# EAGLE board monitoring_board (EAGLE 9.5.1), part 1 of 2
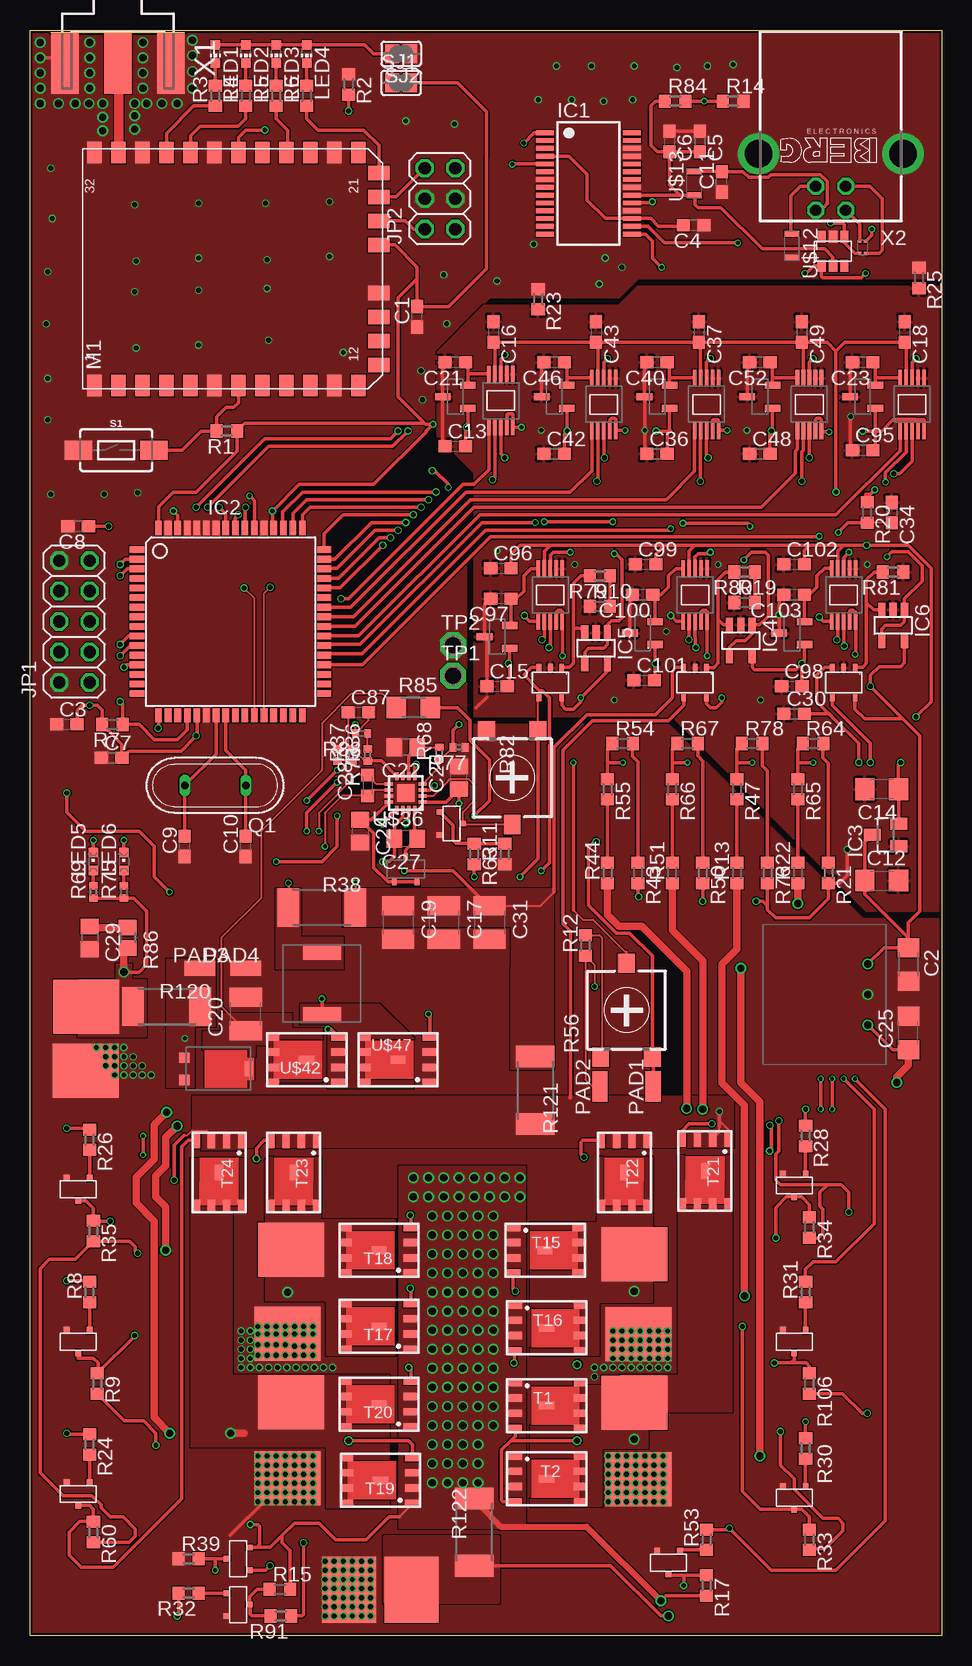
[diagram p5: board, top side]
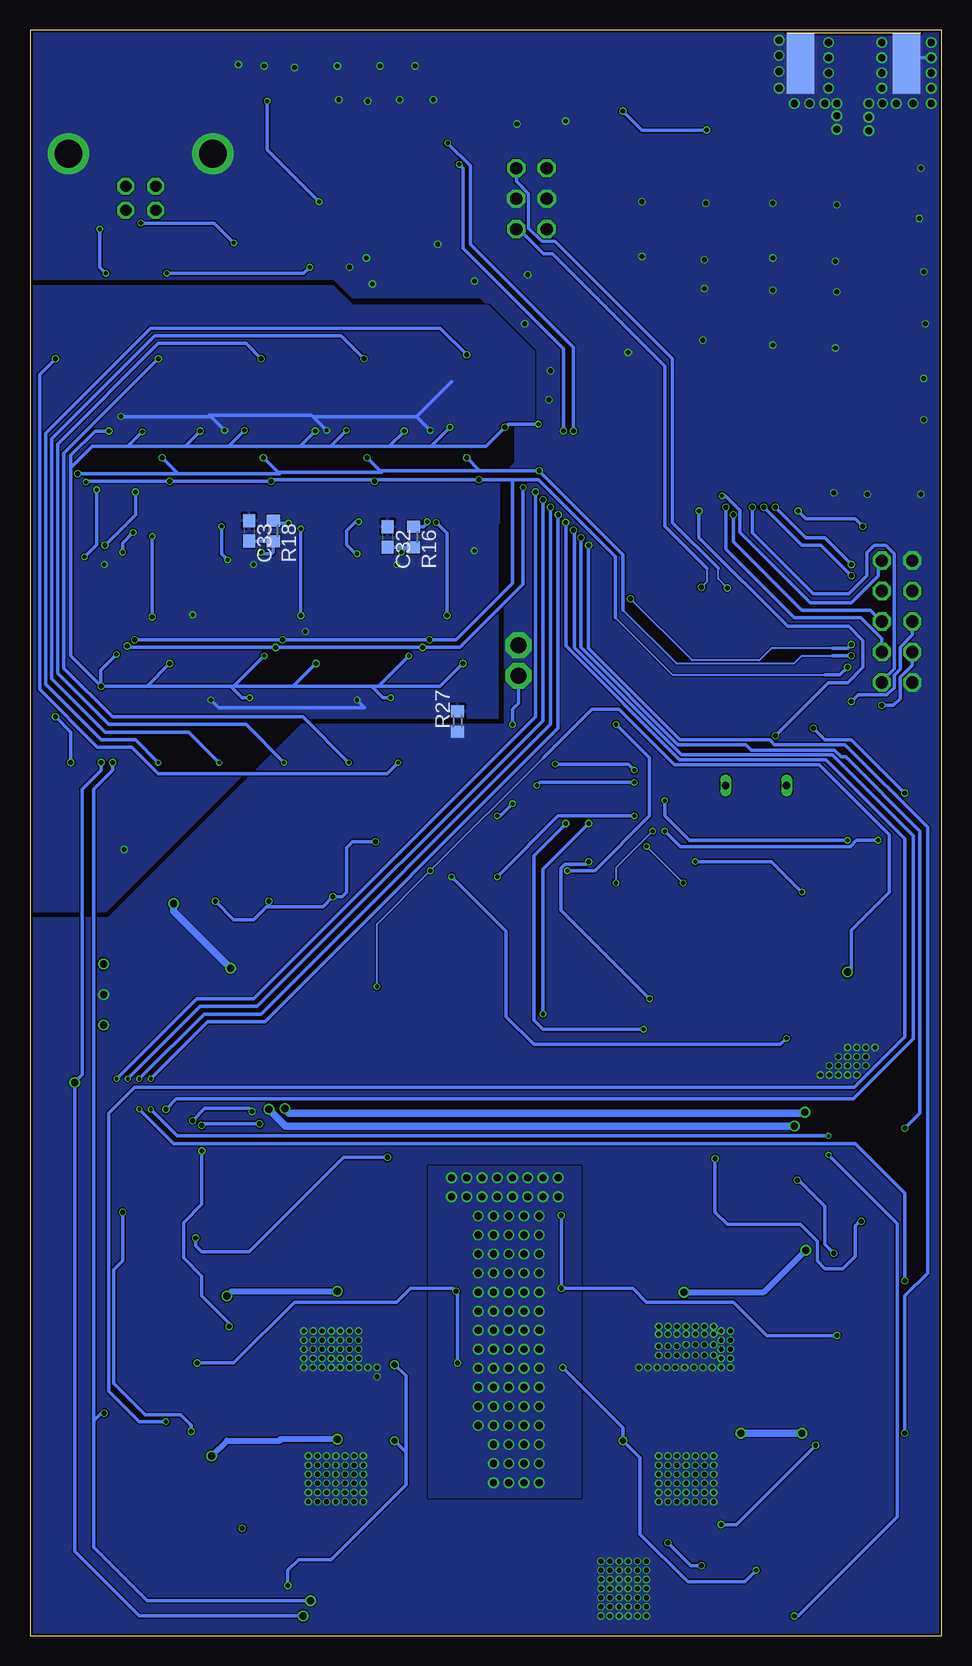
[diagram p6: board, bottom side, seen from below]

Size 76 x 133.8 mm. Coordinates in mm from the lower left corner, seen from the top.
Outline: 0,133.8 76,133.8 76,0 0,0 0,133.8
Copper layers (1*16): Top 0.018mm / dielectric 1.55mm / Bottom 0.018mm
Design rules "Multi-CB_2L_100Êm-Tracks_OL35Êm": minimum track width 0.1mm, minimum drill 0.2mm, track to track 0.1mm, track to pad 0.1mm, pad to pad 0.1mm, via to via 0.1mm, smd to smd 0mil, copper to edge 0.2mm, drill to drill 0.2mm, minimum pad ring 0.125mm, minimum via ring 0.1mm, stop-mask expansion 2mil, vias tented up to drill 0.45mm, thermal gap 0.2mm
Net classes: 1 ant: width 0.8 mm, clearance 0.1 mm

## Footprints (pad centres in the part's own frame; a part is rotated, then mirrored left to right if it is on the bottom)
SMDPAD = smd 4.5 x 5.5: 1 0.03,0.02
C0603 = smd 1.1 x 1: 1 -0.85,0; 2 0.85,0
C1206 = smd 1.6 x 1.8: 1 -1.4,0; 2 1.4,0
C1210 = smd 1.6 x 2.7: 1 -1.4,0; 2 1.4,0
C0805 = smd 1.3 x 1.5: 1 -0.95,0; 2 0.95,0
C0603K = smd 1.05 x 1.08: 1 -0.875,0; 2 0.875,0
SSOP28 = smd 0.4 x 1.5: 1 -4.225,-3.625; 2 -3.575,-3.625; 3 -2.925,-3.625; 4 -2.275,-3.625; 5 -1.625,-3.625; 6 -0.975,-3.625; 7 -0.325,-3.625; 8 0.325,-3.625; 9 0.975,-3.625; 10 1.625,-3.625; 11 2.275,-3.625; 12 2.925,-3.625; 13 3.575,-3.625; 14 4.225,-3.625; 15 4.225,3.625; 16 3.575,3.625; 17 2.925,3.625; 18 2.275,3.625; 19 1.625,3.625; 20 0.975,3.625; 21 0.325,3.625; 22 -0.325,3.625; 23 -0.975,3.625; 24 -1.625,3.625; 25 -2.275,3.625; 26 -2.925,3.625; 27 -3.575,3.625; 28 -4.225,3.625
TQFP64 = smd 1.194 x 0.559: 1 -7.8,6; 2 -7.8,5.2; 3 -7.8,4.4; 4 -7.8,3.6; 5 -7.8,2.8; 6 -7.8,2; 7 -7.8,1.2; 8 -7.8,0.4; 9 -7.8,-0.4; 10 -7.8,-1.2; 11 -7.8,-2; 12 -7.8,-2.8; 13 -7.8,-3.6; 14 -7.8,-4.4; 15 -7.8,-5.2; 16 -7.8,-6; 33 7.8,-6; 34 7.8,-5.2; 35 7.8,-4.4; 36 7.8,-3.6; 37 7.8,-2.8; 38 7.8,-2; 39 7.8,-1.2; 40 7.8,-0.4; 41 7.8,0.4; 42 7.8,1.2; 43 7.8,2; 44 7.8,2.8; 45 7.8,3.6; 46 7.8,4.4; 47 7.8,5.2; 48 7.8,6 | smd 0.559 x 1.194: 17 -6,-7.8; 18 -5.2,-7.8; 19 -4.4,-7.8; 20 -3.6,-7.8; 21 -2.8,-7.8; 22 -2,-7.8; 23 -1.2,-7.8; 24 -0.4,-7.8; 25 0.4,-7.8; 26 1.2,-7.8; 27 2,-7.8; 28 2.8,-7.8; 29 3.6,-7.8; 30 4.4,-7.8; 31 5.2,-7.8; 32 6,-7.8; 49 6,7.8; 50 5.2,7.8; 51 4.4,7.8; 52 3.6,7.8; 53 2.8,7.8; 54 2,7.8; 55 1.2,7.8; 56 0.4,7.8; 57 -0.4,7.8; 58 -1.2,7.8; 59 -2,7.8; 60 -2.8,7.8; 61 -3.6,7.8; 62 -4.4,7.8; 63 -5.2,7.8; 64 -6,7.8
SOT23 = smd 1 x 1.4: 1 -0.95,-1.1; 2 0.95,-1.1; 3 0,1.1
SOT23-5 = smd 0.6 x 1.2: 1 -0.95,-1.306; 2 0,-1.306; 3 0.95,-1.306; 4 0.95,1.306; 5 -0.95,1.306
2X05 = drill 1.016 octagon: 1 -5.08,-1.27; 2 -5.08,1.27; 3 -2.54,-1.27; 4 -2.54,1.27; 5 0,-1.27; 6 0,1.27; 7 2.54,-1.27; 8 2.54,1.27; 9 5.08,-1.27; 10 5.08,1.27
2X03 = drill 1.016 octagon: 1 -2.54,-1.27; 2 -2.54,1.27; 3 0,-1.27; 4 0,1.27; 5 2.54,-1.27; 6 2.54,1.27
CHIP-LED0603 = smd 0.8 x 0.8: A 0,-0.75; C 0,0.75
CHIPLED_0603 = smd 0.8 x 0.8: A 0,-0.75; C 0,0.75
IM-X8X = smd 1.8 x 1.2: P$1 0,-2; P$2 0,-4; P$3 0,-6; P$4 0,-8; P$5 0,-10; P$6 0,-12; P$7 0,-14; P$8 0,-16; P$9 0,-18; P$10 0,-20; P$11 0,-22; P$12 0,-24; P$21 19.4,-24; P$22 19.4,-22; P$23 19.4,-20; P$24 19.4,-18; P$25 19.4,-16; P$26 19.4,-14; P$27 19.4,-12; P$28 19.4,-10; P$29 19.4,-8; P$30 19.4,-6; P$31 19.4,-4; P$32 19.4,-2 | smd 1.2 x 1.8: P$13 1.7,-25.7; P$14 3.7,-25.7; P$15 5.7,-25.7; P$16 7.7,-25.7; P$17 11.7,-25.7; P$18 13.7,-25.7; P$19 15.7,-25.7; P$20 17.7,-25.7
SMD1,27-2,54 = smd 1.27 x 2.54: 1 0,0
QS = drill 0.61 long: 1 -2.54,0; 2 2.54,0
R0603 = smd 1 x 1.1: 1 -0.85,0; 2 0.85,0
R0402 = smd 0.6 x 0.7: 1 -0.5,0; 2 0.5,0
R2512 = smd 1.8 x 3.2: 1 -2.8,0; 2 2.8,0
RTRIMCA6 = smd 1.4 x 1.6: 1 -2.15,-3.9; 2 0,3.9; 3 2.15,-3.9
R1206 = smd 1.6 x 1.803: 1 -1.422,0; 2 1.422,0
R2012 = smd 1.3 x 1.5: 1 -0.85,0; 2 0.85,0
TACTILE_SWITCH_SMD_6.0X3.5MM = smd 2.3 x 1.6: 1 -3.15,0; 2 3.15,0
SJ = smd 1.168 x 1.6: 1 -0.762,0; 2 0.762,0
SI7157DP = smd 1.27 x 0.61: 1 -2.67,1.905; 2 -2.67,0.635; 3 -2.67,-0.635; 4 -2.67,-1.905 | smd 1.02 x 0.61: 5 2.795,-1.905; 6 2.795,-0.635; 7 2.795,0.635; 8 2.795,1.905 | smd 1.27 x 0.635: 9 0,0
P1-13 = drill 1.321 pad 2.159 octagon: TP 0,0
TSR-1-XXXX = drill 0.6: P$1 -2.5,-3.6; P$2 0.04,-3.6; P$3 2.58,-3.6
NXP_BC847 = smd 0.48 x 0.55: 1 -0.95,-0.953; 2 0.95,-0.953; 3 0,0.953
REF31XX-Q1 = smd 0.6 x 1.3: 1 0.95,1.05; 2 -0.95,1.05; 3 0,-1.05
NXP_BC857 = smd 0.48 x 0.55: 1 -0.95,-0.953; 2 0.95,-0.953; 3 0,0.953
MCP33131-05 = smd 0.3 x 1.4: 1 -1,2.2; 2 -0.5,2.2; 3 0,2.2; 4 0.5,2.2; 5 1,2.2; 6 -1,-2.2; 7 -0.5,-2.2; 8 0,-2.2; 9 0.5,-2.2; 10 1,-2.2
DLP11SN900HL2 = smd 0.25 x 0.3: 1 -0.5,0.252; 2 0.501,0.252; 3 0.501,-0.252; 4 -0.5,-0.252
BLM21PG221SN1 = smd 0.5 x 1.25: 1 -1,0; 2 1,0
NUP2201MR6 = smd 0.7 x 1: 1 -0.95,-1.2; 2 0,-1.2; 3 0.95,-1.2; 4 -0.95,1.2; 5 0,1.2; 6 0.95,1.2
INA138 = smd 0.4 x 0.625: 1 0.95,1.25; 2 0,1.25; 3 -0.95,1.25; 4 -0.95,-1.25; 5 0.95,-1.25
BQ24650 = smd 0.7 x 0.3: 1 -1.4,0.75; 2 -1.4,0.25; 3 -1.4,-0.25; 4 -1.4,-0.75; 9 1.4,-0.75; 10 1.4,-0.25; 11 1.4,0.25; 12 1.4,0.75 | smd 0.3 x 0.7: 5 -0.75,-1.4; 6 -0.25,-1.4; 7 0.25,-1.4; 8 0.75,-1.4; 13 0.75,1.4; 14 0.25,1.4; 15 -0.25,1.4; 16 -0.75,1.4 | smd 1.45 x 1.45: EXP 0,0
SIR404DP = smd 1.27 x 0.61: 1 -2.67,1.905; 2 -2.67,0.635; 3 -2.67,-0.635; 4 -2.67,-1.905 | smd 1.02 x 0.61: 5 2.795,-1.905; 6 2.795,-0.635; 7 2.795,0.635; 8 2.795,1.905 | smd 1.27 x 0.635: 9 0,0
IHLP-2525CZ-01 = smd 1.27 x 3.18: 1 -2.6,0; 2 2.6,0
2N7002 = smd 0.48 x 0.55: 1 -0.95,-0.953; 2 0.95,-0.953; 3 0,0.953
BAT54C = smd 0.4 x 0.6: 1 -0.95,-1.05; 2 0.95,-1.05; 3 0,1.05
PDS1040 = smd 0.89 x 0.85: 1 -2.83,0.92; 2 -2.83,-0.92 | smd 0.635 x 1.27: P$1 2.54,0
J502-ND-142-0701-801/806 = smd 5.08 x 2.286: 1 2.565,0; G@1 2.565,4.42; G@2 2.565,-4.42 | smd 5.08 x 2.286 bottom: G@3 2.565,4.42; G@4 2.565,-4.42
PN61729-S = drill 0.95 octagon: 1 1.25,4.71; 2 -1.25,4.71; 3 -1.25,2.71; 4 1.25,2.71 | drill 2.3 pad 2.9: S1 -6.02,0; S2 6.02,0

## Placement (x,y rotation side)
+V_LOAD  SMDPAD  [SMDPAD]  31.83,3.86 180 top
BAT0+  SMDPAD  [SMDPAD]  50.38,19.41 270 top
BAT0-  SMDPAD  [SMDPAD]  50.69,13.06 270 top
BAT1+  SMDPAD  [SMDPAD]  50.38,31.8 270 top
BAT1-  SMDPAD  [SMDPAD]  50.69,25.13 270 top
BAT2+  SMDPAD  [SMDPAD]  21.8,32.11 90 top
BAT2-  SMDPAD  [SMDPAD]  21.48,25.13 90 top
BAT3+  SMDPAD  [SMDPAD]  21.8,19.41 90 top
BAT3-  SMDPAD  [SMDPAD]  21.48,13.06 90 top
C1  1u/6,3V  [C0603]  32.28,109.9 90 top
C2  10u/5,6V  [C1206]  73.23,55.93 270 top
C3  100n  [C0603]  3.07,75.93 0 top
C4  100n  [C0603]  55.33,117.52 180 top
C5  4.7u  [C0603]  55.84,124.51 270 top
C6  100n  [C0603]  53.3,124.51 270 top
C7  100n  [C0603]  6.81,73.14 0 top
C8  100n  [C0603]  4.02,92.44 180 top
C9  22p  [C0603]  12.91,65.77 90 top
C10  22p  [C0603]  17.99,65.77 90 top
C11  10n  [C0603]  57.68,121.14 90 top
C12  1u/5,6V  [C1206]  71.01,62.91 0 top
C13  100n  [C0603]  35.45,99.11 0 top
C14  1u/5.6V  [C1206]  71.01,70.53 180 top
C15  100n  [C0603]  38.95,79.11 0 top
C16  100n  [C0603]  38.63,108.63 270 top
C17  22u/35V  [C1210]  34.5,59.42 270 top
C18  100n  [C0603]  72.92,108.63 270 top
C19  10uF/35V  [C1210]  30.69,59.42 270 top
C20  10uF  [C1210]  17.99,51.8 90 top
C21  10u  [C0603]  35.45,106.09 180 top
C22  1uF  [C0805]  31.32,74.03 180 top
C23  10u  [C0603]  69.42,106.09 180 top
C24  1uF  [C0805]  27.52,67.04 270 top
C25  47u/25V  [C1206]  73.23,50.21 90 top
C26  1uF  [C0805]  35.77,71.48 90 top
C27  100nF  [C0805]  31.32,66.41 180 top
C28  0.1uF  [C0603K]  28.15,70.85 90 top
C29  2.2uF  [C0805]  4.97,58.15 270 top
C30  100n  [C0603]  63.71,76.82 0 top
C31  10uF/35V  [C1210]  38.31,59.42 270 top
C32  3300p  [C0603]  46.18,91.55 270 bottom
C33  3300p  [C0603]  57.74,92.06 270 bottom
C34  3300p  [C0603]  71.84,93.58 270 top
C36  100n  [C0603]  52.28,98.47 0 top
C37  100n  [C0603]  55.77,108.63 270 top
C40  10u  [C0603]  52.28,106.09 180 top
C42  100n  [C0603]  43.71,98.47 0 top
C43  100n  [C0603]  47.2,108.63 270 top
C46  10u  [C0603]  43.71,106.09 180 top
C48  100n  [C0603]  60.85,98.47 0 top
C49  100n  [C0603]  64.34,108.63 270 top
C52  10u  [C0603]  60.85,106.09 180 top
C87  22p  [C0603]  27.39,76.95 0 top
C95  100n  [C0603]  69.42,98.79 0 top
C96  100n  [C0603]  39.26,88.95 0 top
C97  10u  [C0603]  39.26,86.41 180 top
C98  100n  [C0603]  63.52,79.11 0 top
C99  100n  [C0603]  51.33,89.27 0 top
C100  10u  [C0603]  51.07,86.72 180 top
C101  100n  [C0603]  51.2,79.61 0 top
C102  100n  [C0603]  63.71,89.27 0 top
C103  10u/5.6V  [C0603]  63.71,86.72 180 top
IC1  FT232RL  [SSOP28]  46.56,121.02 270 top
IC2  MEGA64-A  [TQFP64]  16.72,84.5 0 top
IC3  MCP1703CB  [SOT23]  71.33,66.72 90 top
IC4  OPA340N  [SOT23-5]  59.27,82.92 180 top
IC5  OPA340N  [SOT23-5]  47.2,82.28 180 top
IC6  OPA340N  [SOT23-5]  71.97,84.19 180 top
JP1  [2X05]  3.7,84.5 90 top
JP2  [2X03]  34.18,119.75 90 top
LED1  green  [CHIP-LED0603]  15.45,131.81 180 top
LED2  green  [CHIP-LED0603]  17.99,131.81 180 top
LED3  green  [CHIP-LED0603]  20.53,131.81 180 top
LED4  green  [CHIP-LED0603]  23.07,131.81 180 top
LED5  green  [CHIPLED_0603]  5.29,64.5 0 top
LED6  green  [CHIPLED_0603]  7.83,64.5 0 top
M1  IM-X8X  [IM-X8X]  3.39,104.19 90 top
PAD1  V-R56  [SMD1,27-2,54]  51.96,45.77 0 top
PAD2  V+R56  [SMD1,27-2,54]  47.52,45.77 0 top
PAD3  V+R82  [SMD1,27-2,54]  14.18,55.61 90 top
PAD4  V-R82  [SMD1,27-2,54]  17.99,55.61 90 top
Q1  7.3728 MHz  [QS]  15.45,70.85 180 top
R1  47k  [R0603]  16.4,100.38 180 top
R2  47k  [R0603]  26.56,129.27 270 top
R3  47k  [R0603]  15.45,128.32 90 top
R4  47k  [R0603]  17.99,128.32 90 top
R5  47k  [R0603]  20.53,128.32 90 top
R6  47k  [R0603]  23.07,128.32 90 top
R7  47k  [R0603]  6.88,75.93 180 top
R8  1k  [R0603]  4.97,28.62 90 top
R9  18k  [R0603]  5.61,21 270 top
R10  0R  [R0603]  47.52,85.77 0 top
R11  1k  [R0603]  39.58,65.14 90 top
R12  50k  [R0603]  46.31,57.52 90 top
R13  10k  [R0603]  58.95,63.55 90 top
R14  10k  [R0603]  58.63,127.87 0 top
R15  18k  [R0603]  20.85,3.86 0 top
R16  500R  [R0603]  44.02,91.55 270 bottom
R17  18k  [R0603]  56.41,4.17 270 top
R18  500R  [R0603]  55.71,92.06 270 bottom
R19  0R  [R0603]  59.58,86.09 0 top
R20  500  [R0603]  69.81,93.58 270 top
R21  3k9  [R0603]  66.57,63.55 270 top
R22  10k  [R0603]  64.03,63.55 90 top
R23  0R  [R0603]  42.37,111.36 270 top
R24  1k  [R0603]  4.97,15.92 270 top
R25  0R  [R0603]  74.12,113.14 270 top
R26  1k  [R0603]  4.97,41.32 270 top
R27  0R  [R0603]  40.34,76.18 90 bottom
R28  1k  [R0603]  64.66,41.64 270 top
R30  1k  [R0603]  64.66,15.61 270 top
R31  1k  [R0603]  64.66,28.62 90 top
R32  1k  [R0603]  13.23,3.54 180 top
R33  1k  [R0603]  64.98,7.99 270 top
R34  1k  [R0603]  64.98,34.02 270 top
R35  1k  [R0603]  5.29,33.7 270 top
R36  150k 1%  [R0402]  28.15,73.39 90 top
R37  100k 1%  [R0402]  26.88,73.39 90 top
R38  0R0065  [R2512]  24.34,60.69 0 top
R39  18k  [R0603]  13.23,6.4 0 top
R43  3k9  [R0603]  50.69,63.55 270 top
R44  10k  [R0603]  48.15,63.55 90 top
R47  0  [R0603]  58.95,70.53 270 top
R50  3k9  [R0603]  56.09,63.55 270 top
R51  10k  [R0603]  53.55,63.55 90 top
R53  1k  [R0603]  56.41,7.99 90 top
R54  0R  [R0603]  49.42,74.34 0 top
R55  0R  [R0603]  48.15,70.53 270 top
R56  10k  [RTRIMCA6]  49.74,52.12 0 top
R60  1k  [R0603]  5.29,8.62 270 top
R63  1k  [R0603]  37.04,65.14 270 top
R64  0  [R0603]  65.3,74.34 0 top
R65  0  [R0603]  64.03,70.53 270 top
R66  0R  [R0603]  53.55,70.53 270 top
R67  0R  [R0603]  54.82,74.34 0 top
R68  10k  [R0402]  34.12,73.52 90 top
R69  10k  [R0402]  5.29,61.96 90 top
R73  0R  [R0402]  25.61,73.39 270 top
R75  10k  [R0402]  7.83,61.96 90 top
R76  3k9  [R0603]  61.49,63.55 270 top
R77  15k  [R0402]  35.77,74.03 180 top
R78  0  [R0603]  60.22,74.34 0 top
R79  560K  [R0603]  47.52,88.31 180 top
R80  560k  [R0603]  59.58,88.63 180 top
R81  820k  [R0603]  71.97,88.63 180 top
R82  [RTRIMCA6]  40.22,71.48 180 top
R84  4k7  [R0603]  53.8,127.87 0 top
R85  10R  [R1206]  31.96,77.33 0 top
R86  2R  [R2012]  8.15,58.15 270 top
R88  150k 1%  [R0402]  27.64,75.17 180 top
R91  1k  [R0603]  20.91,1.64 180 top
R106  18k  [R0603]  64.98,21 270 top
R120  0R003  [R2512]  11.39,52.44 0 top
R121  0R003  [R2512]  42.12,45.45 270 top
R122  500u  [R2512]  37.04,8.62 90 top
S1  MOMENTARY-SWITCH-SPST-SMD-6.0X3.5MM  [TACTILE_SWITCH_SMD_6.0X3.5MM]  7.2,98.79 0 top
SJ1  [SJ]  30.94,129.4 0 top
SJ2  [SJ]  30.94,131.81 180 top
SOLAR+  SMDPAD  [SMDPAD]  4.66,52.44 270 top
SOLAR-  SMDPAD  [SMDPAD]  4.66,47.04 90 top
T1  [SI7157DP]  43.07,19.16 0 top
T2  [SI7157DP]  43.07,13.06 0 top
T15  [SI7157DP]  42.95,32.11 0 top
T16  [SI7157DP]  43.07,25.64 0 top
T17  [SI7157DP]  29.1,25.77 180 top
T18  [SI7157DP]  29.1,32.11 180 top
T19  [SI7157DP]  29.23,12.94 180 top
T20  [SI7157DP]  29.1,19.29 180 top
T21  [SI7157DP]  56.28,38.72 270 top
T22  [SI7157DP]  49.55,38.59 270 top
T23  [SI7157DP]  21.99,38.59 270 top
T24  [SI7157DP]  15.77,38.59 270 top
TP1  PTR1PAD1-13  [P1-13]  35.26,79.99 0 top
TP2  PTR1PAD1-13  [P1-13]  35.26,82.53 0 top
U$1  TSR-1-XXXX  [TSR-1-XXXX]  66.25,53.39 90 top
U$2  NXP_BC847  [NXP_BC847]  53.23,6.08 180 top
U$4  REF3125-Q1  [REF31XX-Q1]  35.45,103.23 270 top
U$5  REF3125-Q1  [REF31XX-Q1]  43.71,103.23 270 top
U$6  REF3125-Q1  [REF31XX-Q1]  51.07,83.55 270 top
U$8  REF3125-Q1  [REF31XX-Q1]  38.95,83.23 270 top
U$9  NXP_BC857  [NXP_BC857]  17.36,6.4 90 top
U$10  MCP33131-05  [MCP33131-05]  73.55,102.6 0 top
U$11  DLP11SN900HL2  [DLP11SN900HL2]  69.42,115.68 90 top
U$12  BLM21PG221SN1  [BLM21PG221SN1]  63.52,115.81 270 top
U$13  BLM21PG221SN1  [BLM21PG221SN1]  55.39,121.02 90 top
U$14  DUP2201MR6  [NUP2201MR6]  66.95,115.36 180 top
U$16  MCP33131-05  [MCP33131-05]  39.26,102.92 0 top
U$17  MCP33131-05  [MCP33131-05]  47.84,102.6 0 top
U$18  REF3125-Q1  [REF31XX-Q1]  69.42,103.23 270 top
U$19  REF3125-Q1  [REF31XX-Q1]  63.52,83.55 270 top
U$20  MCP33131-05  [MCP33131-05]  56.41,102.6 0 top
U$21  MCP33131-05  [MCP33131-05]  64.98,102.6 0 top
U$22  REF3125-Q1  [REF31XX-Q1]  60.85,103.23 270 top
U$23  REF3125-Q1  [REF31XX-Q1]  52.28,103.23 270 top
U$24  MCP33131-05  [MCP33131-05]  43.39,86.72 0 top
U$25  MCP33131-05  [MCP33131-05]  55.45,86.72 0 top
U$26  MCP33131-05  [MCP33131-05]  67.84,86.72 0 top
U$27  INA138  [INA138]  55.45,79.42 0 top
U$28  INA138  [INA138]  43.39,79.42 0 top
U$29  INA138  [INA138]  67.84,79.42 0 top
U$34  NXP_BC847  [NXP_BC847]  63.71,24.5 180 top
U$35  NXP_BC847  [NXP_BC847]  4.02,24.5 180 top
U$36  BQ24650  [BQ24650]  31.32,70.22 180 top
U$37  NXP_BC847  [NXP_BC847]  17.36,2.59 270 top
U$38  NXP_BC847  [NXP_BC847]  63.71,11.48 180 top
U$39  NXP_BC847  [NXP_BC847]  63.71,37.51 180 top
U$40  NXP_BC847  [NXP_BC847]  4.02,37.2 180 top
U$41  NXP_BC847  [NXP_BC847]  4.02,11.79 180 top
U$42  SIR404DP  [SIR404DP]  23.07,47.99 180 top
U$45  4.7uH /Würth 784 778 047  [IHLP-2525CZ-01]  24.34,54.34 90 top
U$46  2N7002  [2N7002]  35.13,67.67 270 top
U$47  SIR404DP  [SIR404DP]  30.69,47.99 180 top
U$48  BAT54C  [BAT54C]  31.32,63.87 0 top
U$49  PDS1040  [PDS1040]  15.7,47.23 0 top
V_LOAD-  SMDPAD  [SMDPAD]  26.63,3.86 180 top
X1  SMA-142-0701-801/806  [J502-ND-142-0701-801/806]  7.32,133.59 270 top
X2  PN61729-S  [PN61729-S]  66.76,123.49 180 top